# Altium schematic sheet AudioAmplifier.SchDoc
size A4
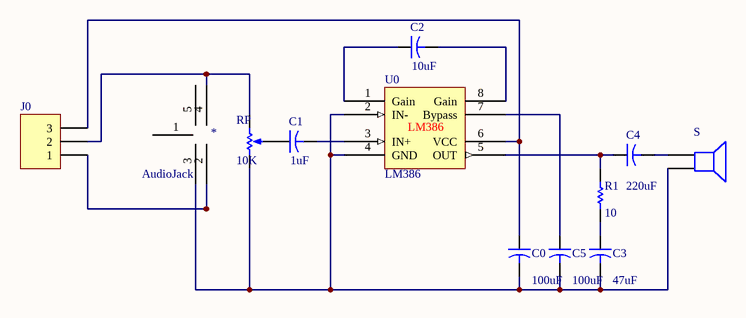
[diagram p0: AudioAmplifier.SchDoc]

## Parts
*  AudioJack  [AudioJack_3.5mm]
C0  value 100uF  [CAPR5-4X5]  (hidden comment: Cap2)
C1  value 1uF  [CAPR5-4X5]  (hidden comment: Cap2)
C2  value 10uF  [CAPR5-4X5]  (hidden comment: Cap2)
C3  value 47uF  [CAPR5-4X5]  (hidden comment: Cap2)
C4  value 220uF  [CAPR5-4X5]  (hidden comment: Cap2)
C5  value 100uF  [CAPR5-4X5]  (hidden comment: Cap2)
J0  Header 3H  [HDR1X3H]  (value not drawn)
R1  value 10  [AXIAL-0.3]  (hidden comment: Res1)
R?  RP  value 10K  [VR5]
S  Speaker  [PIN2]  (value not drawn)
U0  LM386  [DIP8]

## Nets
Net*_2: *.2(中环) J0.1
Net*_3: *.3(中环) C0.2 C3.2 C5.2 R?.1(TOP) S.2 U0.2(IN-) U0.4(GND)
Net*_4: *.4(内环) J0.2 R?.2(BOT)
NetC0_1: C0.1 J0.3 U0.6(VCC)
NetC1_1: C1.1 R?.3(TAP)
NetC1_2: C1.2 U0.3(IN+)
NetC2_1: C2.1 U0.1(Gain)
NetC2_2: C2.2 U0.8(Gain)
NetC3_1: C3.1 R1.1
NetC4_1: C4.1 R1.2 U0.5(OUT)
NetC4_2: C4.2 S.1
NetC5_1: C5.1 U0.7(Bypass)

Not connected (* = marked no-connect by the designer): * 1(外环) 5(内环)

## Library data of the parts
* = AudioJack_3.5mm
C0-C5 = Cap2: Capacitor; Published: 23-Sep-2002; PackageReference: CAPR5-4X5; Publisher: Altium Limited; PackageDescription: Capacitor; 2 Leads
J0 = Header 3H: Header, 3-Pin, Right Angle; LatestRevisionDate: 17-Jul-2002; LatestRevisionNote: Re-released for DXP Platform.; Publisher: Altium Limited
R1 = Res1: Resistor; Published: 8-Jun-2000; LatestRevisionDate: 17-Jul-2002; LatestRevisionNote: Re-released for DXP Platform.; PackageReference: AXIAL-0.3; Publisher: Altium Limited; PackageDescription: Axial Device, Thru-Hole; 2 Leads; 0.3 in Pin Spacing
R? = RPot: Potentiometer; Sim Note: Enter the Resistance value and the set point into parameter fields.; Set Position: 0.5; Published: 8-Jun-2000; LatestRevisionDate: 17-Jul-2002; LatestRevisionNote: Re-released for DXP Platform.; PackageReference: VR5; Publisher: Altium Limited; PackageDescription: Variable Resistor, Thru-Hole; 3 Leads
S = Speaker: Loudspeaker; Published: 24-Mar-1999; LatestRevisionDate: 17-Jul-2002; LatestRevisionNote: Re-released for DXP Platform.; PackageReference: PIN2; Publisher: Altium Limited